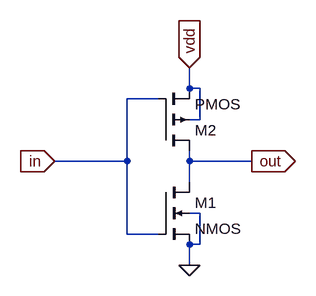
[diagram p0: schematic inverter.asc]
inverter.asc, the LTspice schematic file:
Version 4
SHEET 1 880 680
WIRE 224 48 224 16
WIRE 240 48 224 48
WIRE 176 64 128 64
WIRE 240 96 240 48
WIRE 240 96 224 96
WIRE 128 160 128 64
WIRE 128 160 16 160
WIRE 224 160 224 144
WIRE 320 160 224 160
WIRE 224 192 224 160
WIRE 240 240 224 240
WIRE 128 272 128 160
WIRE 176 272 128 272
WIRE 240 288 240 240
WIRE 240 288 224 288
WIRE 224 320 224 288
FLAG 224 320 0
FLAG 16 160 in
IOPIN 16 160 In
FLAG 320 160 out
IOPIN 320 160 Out
FLAG 224 16 vdd
IOPIN 224 16 In
SYMBOL nmos4 176 192 R0
SYMATTR InstName M1
SYMATTR Value2 l=90n w=200n
SYMBOL pmos4 176 144 M180
SYMATTR InstName M2
SYMATTR Value2 l=90n w=400n

The netlist it stands for:
* inverter.asc
M1 out in 0 0 NMOS l=90n w=200n
M2 out in vdd vdd PMOS l=90n w=400n
.model NMOS NMOS
.model PMOS PMOS
.lib standard.mos
.backanno
.end